# EasyEDA Pro project Baby8-Seq.eprj

# Board Board
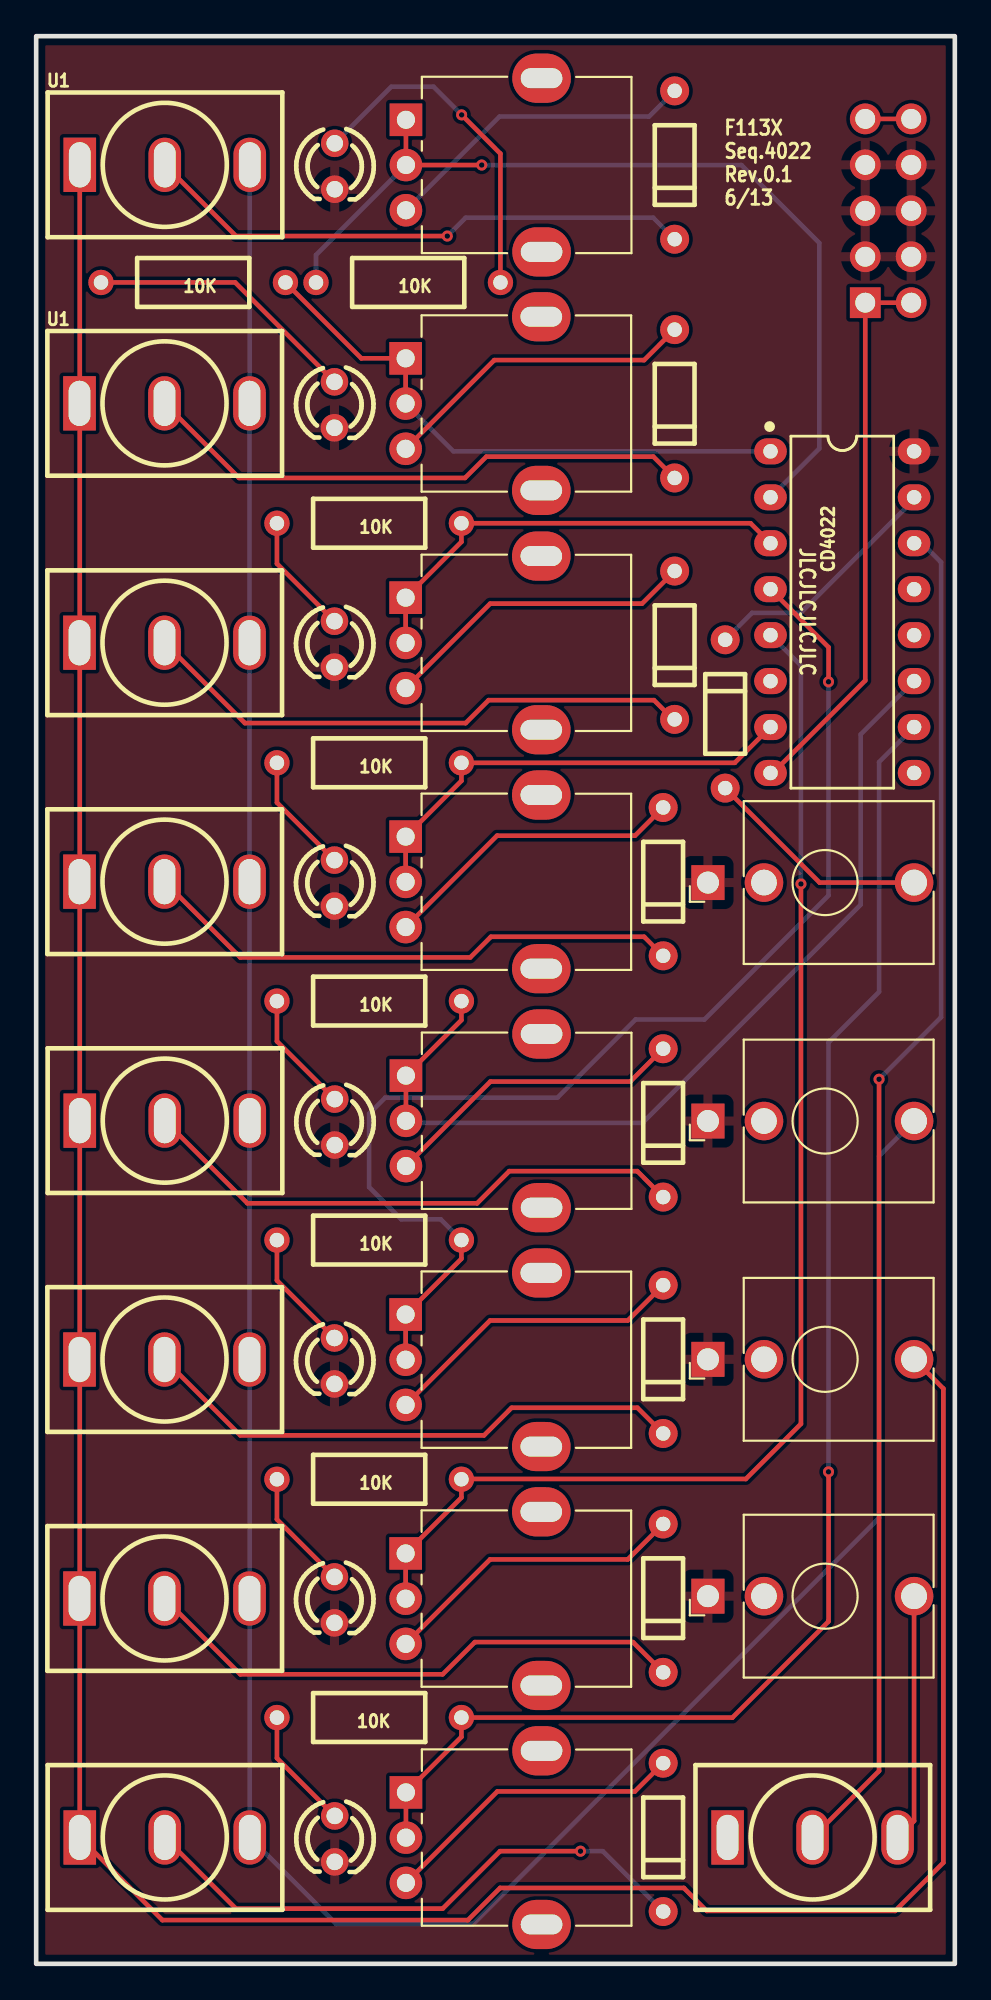
[diagram p0: board, top side]
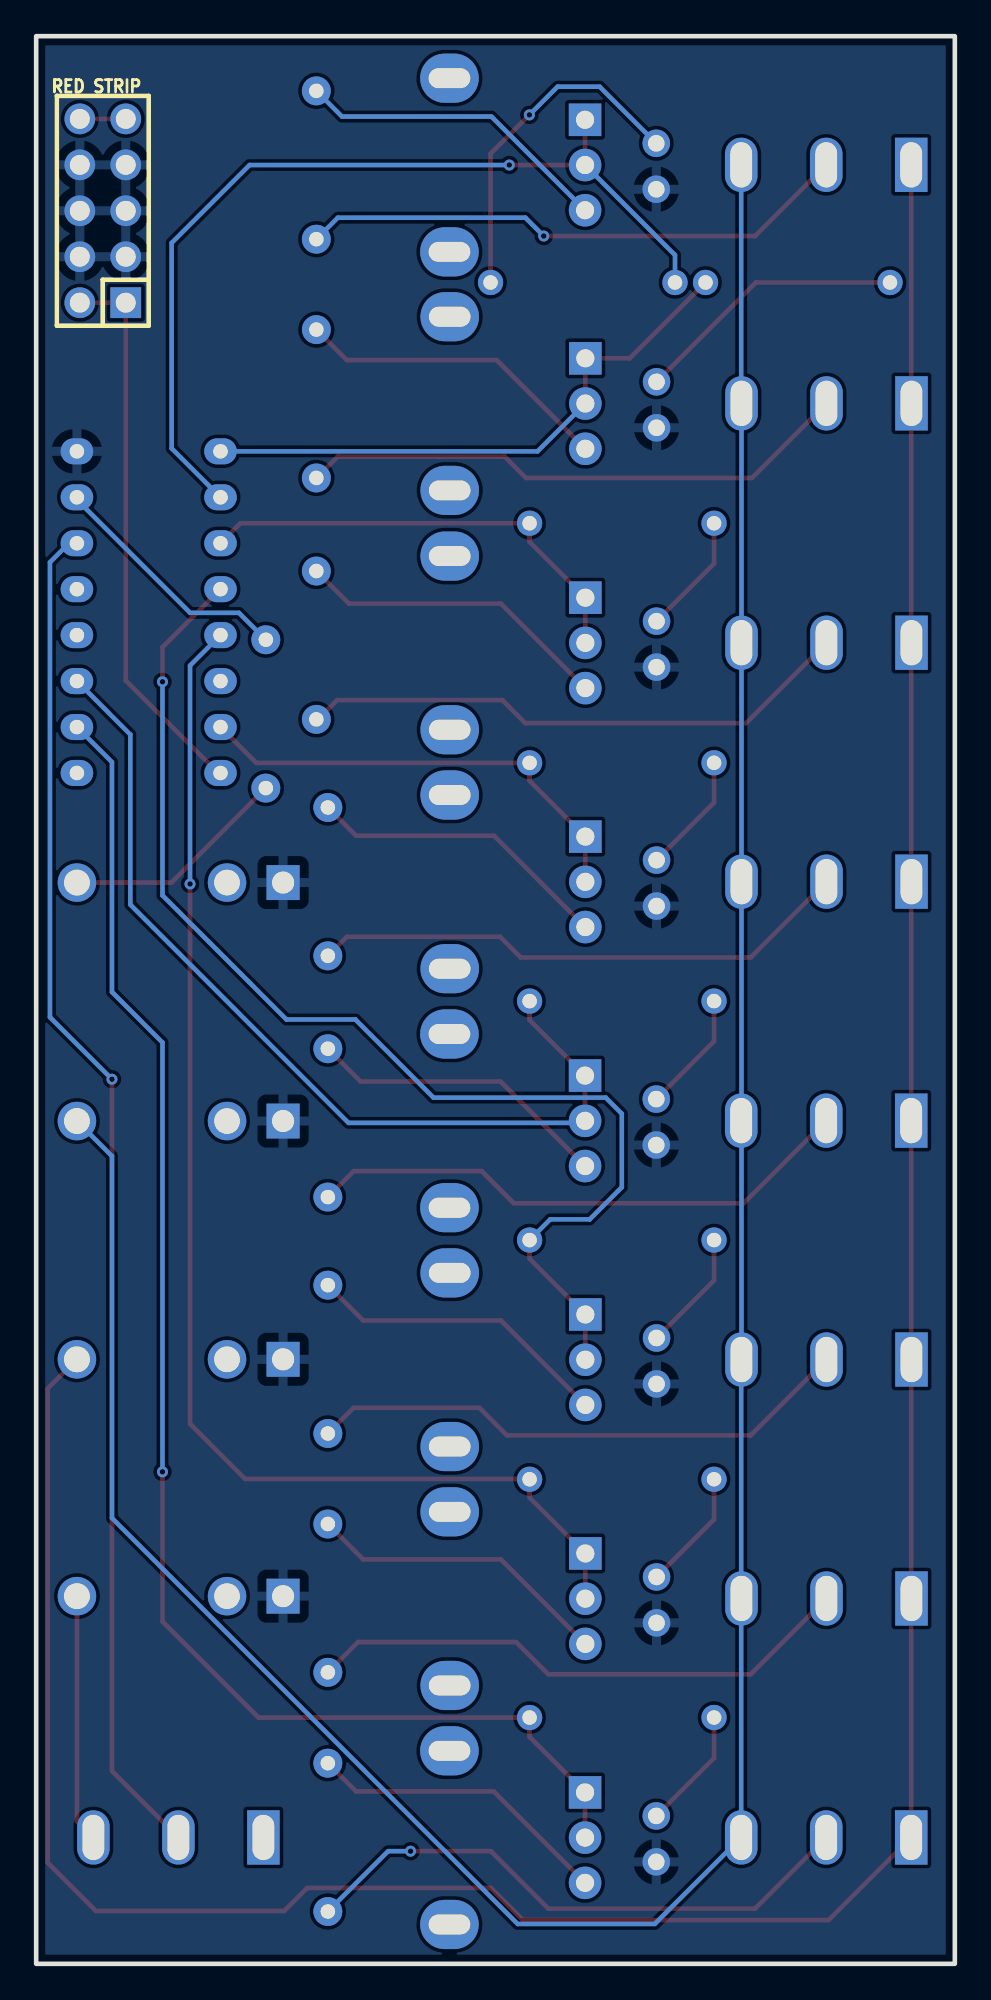
[diagram p1: board, bottom side, seen from below]

Outline 50.8 x 106.56 mm; copper layers: Top Layer, Bottom Layer. Coordinates in mm from the lower left corner of the outline.
Outline path: rectangle 0,106.56 50.8,0
Stack: Top Layer 0.035mm / Dielectric1 1.51mm FR4 er 4.5 / Bottom Layer 0.035mm

## Design rules (mm)
template: JLCPCB Capability(Two Layers Board)
spacing copperThickness1oz (default): track to track 0.102, other pairs 0.152 to 0.3
spacing copperThickness2oz: track to track 0.203, other pairs 0.152 to 0.3
track width copperThickness1oz (default): min 0.127, default 0.254, max 2.54
track width copperThickness2oz: min 0.203, default 0.254, max 2.54
differential pair differentialPair (default): width min 0.127, default 0.254, max 2.54; gap min 0.152, default 0.152
via viaSize (default): diameter min 0.5, default 0.61, max 10; hole min 0.3, default 0.305, max 6.3

## Placement (name value [footprint] x y rotation side)
10K  -  [RES-TH_BD2.7-L6.2-P10.20-D0.4]  20.57 92.94 0 top
10K#2  -  [RES-TH_BD2.7-L6.2-P10.20-D0.4]  8.69 92.94 0 top
10K#3  -  [RES-TH_BD2.7-L6.2-P10.20-D0.4]  18.41 79.63 0 top
10K#4  -  [RES-TH_BD2.7-L6.2-P10.20-D0.4]  18.41 66.39 0 top
10K#5  -  [RES-TH_BD2.7-L6.2-P10.20-D0.4]  18.41 53.22 0 top
10K#6  -  [RES-TH_BD2.7-L6.2-P10.20-D0.4]  18.41 40.01 0 top
10K#7  -  [RES-TH_BD2.7-L6.2-P10.20-D0.4]  18.41 26.78 0 top
10K#8  -  [RES-TH_BD2.7-L6.2-P10.20-D0.4]  18.41 13.61 0 top
CD4022  CD4017CN  [PDIP-16_L19.3-W6.4-P2.54-LS7.94-BL]  44.58 74.72 270 top
D1  -  [DO-35_BD2.0-L4.2-P8.20-D0.5-RD]  34.67 59.82 90 top
D1#2  -  [DO-35_BD2.0-L4.2-P8.20-D0.5-RD]  35.31 99.43 90 top
D1#3  -  [DO-35_BD2.0-L4.2-P8.20-D0.5-RD]  35.31 86.24 90 top
D1#4  -  [DO-35_BD2.0-L4.2-P8.20-D0.5-RD]  35.31 72.89 90 top
D1#5  -  [DO-35_BD2.0-L4.2-P8.20-D0.5-RD]  34.67 46.48 90 top
D1#6  -  [DO-35_BD2.0-L4.2-P8.20-D0.5-RD]  34.67 33.42 90 top
D1#7  -  [DO-35_BD2.0-L4.2-P8.20-D0.5-RD]  34.67 20.21 90 top
D1#8  -  [DO-35_BD2.0-L4.2-P8.20-D0.5-RD]  34.67 6.99 90 top
D1#9  -  [DO-35_BD2.0-L4.2-P8.20-D0.5-RD]  38.1 69.09 270 top
J2  -  [benjiaomodular:AudioJack_3.5mm]  37.15 46.59 90 top
J2#2  -  [benjiaomodular:AudioJack_3.5mm]  37.15 33.42 90 top
J2#3  -  [benjiaomodular:AudioJack_3.5mm]  37.15 20.32 90 top
J2#4  -  [benjiaomodular:AudioJack_3.5mm]  37.15 59.77 90 top
LED1  -  [LED-TH_BD3.0-P2.54-FD]  16.5 72.95 270 top
LED1#2  -  [LED-TH_BD3.0-P2.54-FD]  16.5 59.74 270 top
LED1#3  -  [LED-TH_BD3.0-P2.54-FD]  16.51 46.53 270 top
LED1#4  -  [LED-TH_BD3.0-P2.54-FD]  16.51 6.91 270 top
LED1#5  -  [LED-TH_BD3.0-P2.54-FD]  16.5 20.12 270 top
LED1#6  -  [LED-TH_BD3.0-P2.54-FD]  16.5 33.32 270 top
LED1#7  -  [LED-TH_BD3.0-P2.54-FD]  16.51 99.36 270 top
LED1#8  -  [LED-TH_BD3.0-P2.54-FD]  16.5 86.18 270 top
RED STRIP  ZX-PZ2.54-2-5PZZ  [HDR-TH_10P-P2.54-V-M-R2-C5-S2.54]  47.12 96.9 90 bottom
RV7  -  [benjiaomodular:Potentiometer_RV09]  20.43 75.52 0 top
RV7#2  -  [benjiaomodular:Potentiometer_RV09]  20.43 62.31 0 top
RV7#3  -  [benjiaomodular:Potentiometer_RV09]  20.45 49.1 0 top
RV7#4  -  [benjiaomodular:Potentiometer_RV09]  20.45 9.47 0 top
RV7#5  -  [benjiaomodular:Potentiometer_RV09]  20.43 35.89 0 top
RV7#6  -  [benjiaomodular:Potentiometer_RV09]  20.43 22.69 0 top
RV7#7  -  [benjiaomodular:Potentiometer_RV09]  20.45 101.93 0 top
RV7#8  -  [benjiaomodular:Potentiometer_RV09]  20.43 88.75 0 top
U1  -  [SW-TH_MT-0-103-A101-M200-RS]  7.1 73.03 0 top
U1#2  -  [SW-TH_MT-0-103-A101-M200-RS]  7.1 59.82 0 top
U1#3  -  [SW-TH_MT-0-103-A101-M200-RS]  7.11 46.61 0 top
U1#4  -  [SW-TH_MT-0-103-A101-M200-RS]  7.11 6.99 0 top
U1#5  -  [SW-TH_MT-0-103-A101-M200-RS]  7.1 20.2 0 top
U1#6  -  [SW-TH_MT-0-103-A101-M200-RS]  7.1 33.4 0 top
U1#7  -  [SW-TH_MT-0-103-A101-M200-RS]  42.94 6.99 0 top
U1#8  -  [SW-TH_MT-0-103-A101-M200-RS]  7.11 99.44 0 top
U1#9  -  [SW-TH_MT-0-103-A101-M200-RS]  7.1 86.26 0 top

## Footprints (pads in the part's own frame, mm; a bottom-side part is the same pattern mirrored in y, then rotated)
benjiaomodular:AudioJack_3.5mm
  rect 1.93x1.83 hole 1.22: S(0,0)
  round 2.13 hole 1.43: T(0,-11.4)
  round 2.13 hole 1.42: TN(0,-3.1)
benjiaomodular:Potentiometer_RV09
  rect 1.8x1.8 hole 1: 1(0,0)
  round 1.8 hole 1: 2(0,-2.5) 3(0,-5)
  oval 3.24x2.72 hole 2.3x1.1: 4(7.5,-7.3) 5(7.5,2.3)
DO-35_BD2.0-L4.2-P8.20-D0.5-RD
  round 1.6 hole 0.8: 1(-4.1,0) 2(4.1,0)
HDR-TH_10P-P2.54-V-M-R2-C5-S2.54
  rect 1.7x1.7 hole 1.1: 1(-5.08,-1.27)
  round 1.7 hole 1.1: 2(-5.08,1.27) 3(-2.54,-1.27) 4(-2.54,1.27) 5(0,-1.27) 6(0,1.27) 7(2.54,-1.27) 8(2.54,1.27) 9(5.08,-1.27) 10(5.08,1.27)
LED-TH_BD3.0-P2.54-FD
  round 1.524 hole 0.914: 1(-1.27,0) 2(1.27,0)
PDIP-16_L19.3-W6.4-P2.54-LS7.94-BL
  oval 1.44x1.8 hole 0.8: 1(-8.89,-3.97) 2(-6.35,-3.97) 3(-3.81,-3.97) 4(-1.27,-3.97) 5(1.27,-3.97) 6(3.81,-3.97) 7(6.35,-3.97) 8(8.89,-3.97) 9(8.89,3.97) 10(6.35,3.97) 11(3.81,3.97) 12(1.27,3.97) 13(-1.27,3.97) 14(-3.81,3.97) 15(-6.35,3.97) 16(-8.89,3.97)
RES-TH_BD2.7-L6.2-P10.20-D0.4
  round 1.4 hole 0.8: 1(-5.1,0) 2(5.1,0)
SW-TH_MT-0-103-A101-M200-RS
  rect 1.8x3 hole 1.2x2.5: 1(-4.7,0)
  oval 1.8x3 hole 1.2x2.5: 2(0,0) 3(4.7,0)

## Nets
GND: CD4022.16 J2.S J2#2.S J2#3.S J2#4.S LED1.2 LED1#2.2 LED1#3.2 LED1#4.2 LED1#5.2 LED1#6.2 LED1#7.2 LED1#8.2 RED STRIP.3 RED STRIP.4 RED STRIP.5 RED STRIP.6 RED STRIP.7 RED STRIP.8
+12: CD4022.8 RED STRIP.1 RED STRIP.2
-12: RED STRIP.9 RED STRIP.10
CLK: CD4022.14 U1#7.2
CLK_IN: J2#3.T U1#7.3
CV_OUT1: J2.T U1.3 U1#2.3 U1#3.3 U1#4.3 U1#5.3 U1#6.3 U1#8.3 U1#9.3
CV_OUT2: J2#2.T U1.1 U1#2.1 U1#3.1 U1#4.1 U1#5.1 U1#6.1 U1#8.1 U1#9.1
RST: CD4022.15 D1#9.1
RST_IN: D1#9.2 J2#4.T
STEP1: 10K.1 CD4022.2 RV7#7.1 RV7#7.2
STEP2: 10K#2.2 CD4022.1 RV7#8.1 RV7#8.2
STEP3: 10K#3.2 CD4022.3 RV7.1 RV7.2
STEP4: 10K#4.2 CD4022.7 RV7#2.1 RV7#2.2
STEP5: 10K#5.2 CD4022.11 RV7#3.1 RV7#3.2
STEP6: 10K#6.2 CD4022.4 RV7#5.1 RV7#5.2
STEP7: 10K#7.2 CD4022.5 RV7#6.1 RV7#6.2
STEP8: 10K#8.2 CD4022.10 RV7#4.1 RV7#4.2

Pads without a net: 10K 2; 10K#2 1; 10K#3 1; 10K#4 1; 10K#5 1; 10K#6 1; 10K#7 1; 10K#8 1; CD4022 6 9 12 13; D1 1 2; D1#2 1 2; D1#3 1 2; D1#4 1 2; D1#5 1 2; D1#6 1 2; D1#7 1 2; D1#8 1 2; J2 TN; J2#2 TN; J2#3 TN; J2#4 TN; LED1 1; LED1#2 1; LED1#3 1; LED1#4 1; LED1#5 1; LED1#6 1; LED1#7 1; LED1#8 1; RV7 3 4 5; RV7#2 3 4 5; RV7#3 3 4 5; RV7#4 3 4 5; RV7#5 3 4 5; RV7#6 3 4 5; RV7#7 3 4 5; RV7#8 3 4 5; U1 2; U1#2 2; U1#3 2; U1#4 2; U1#5 2; U1#6 2; U1#7 1; U1#8 2; U1#9 2

## Via types
v1: diameter 0.61, hole 0.305, Top Layer to Bottom Layer, 8 vias

## Routing (per net, layer and track width the routed paths; a pad name or vN(x,y) marks a point on that pad's centre or on a via; arc(x,y) is an arc through that point)
(no net): length 459
  Top Layer w0.254: 10K.2 25.67,100.06 v1(23.53,102.21) ; LED1#8.1 11,92.94 3.58,92.94 ; LED1#5.1 13.31,24.57 10K#7.1 ; D1#7.1 33,17.78 24.26,17.78 22.48,16 11.29,16 U1#5.2 ; LED1#4.1 13.31,11.37 10K#8.1 ; 10K#5.1 13.31,50.99 LED1#3.1 ; D1#8.2 33.11,9.53 25.5,9.53 RV7#4.3 ; U1#4.2 11.05,3.05 22.48,3.05 25.65,6.23 v1(30.1,6.23) ; 10K#3.1 13.31,77.4 LED1.1 ; RV7#3.3 25.12,48.77 32.86,48.77 34.67,50.58 ; v1(22.73,95.51) 11.05,95.51 U1#8.2 ; D1#3.2 33.62,88.65 25.33,88.65 RV7#8.3 ; U1#3.2 11.68,42.04 24.38,42.04 26.16,43.82 33.24,43.82 D1#5.1 ; D1#6.1 33.25,30.74 26.29,30.74 24.76,29.21 11.29,29.21 U1#6.2 ; 10K#6.1 13.31,37.77 LED1#6.1 ; D1#4.1 35.22,68.79 34.16,69.85 25.02,69.85 23.75,68.58 11.54,68.58 U1.2 ; RV7#6.3 25.1,22.35 32.71,22.35 D1#7.2 ; U1#2.2 11.29,55.63 24,55.63 25.15,56.77 33.62,56.77 D1.1 ; RV7#5.3 25.1,35.56 32.72,35.56 D1#6.2 ; D1.2 33.11,62.36 25.48,62.36 RV7#2.3 ; 10K#4.1 13.31,64.19 LED1#2.1 ; U1#9.2 11.22,82.14 23.71,82.14 24.89,83.31 34.13,83.31 D1#3.1 ; RV7.3 25.1,75.19 33.5,75.19 D1#4.2
  Bottom Layer w0.254: D1#2.1 34.12,96.52 23.75,96.52 v1(22.73,95.51) ; v1(23.53,102.21) 21.97,103.76 19.64,103.76 LED1#7.1 ; v1(30.1,6.23) 31.34,6.23 D1#8.1 ; D1#2.2 33.88,102.11 25.62,102.11 RV7#7.3
+12: length 30.7
  Top Layer w0.254: RED STRIP.2 45.85,91.82 45.85,70.94 40.73,65.83
-12: length 2.5
  Top Layer w0.254: RED STRIP.10 45.85,101.98
CLK: length 75.2
  Top Layer w0.254: U1#7.2 46.61,10.66 v1(46.61,48.9)
  Bottom Layer w0.254: 48.67,78.53 48.98,78.53 50.04,77.47 50.04,52.33 v1(46.61,48.9)
CLK_IN: length 13.7
  Top Layer w0.254: J2#3.T 48.55,7.9 U1#7.3
CV_OUT1: length 161.3
  Bottom Layer w0.254: J2.T 46.61,44.65 46.61,24.64 24.17,2.2 16.59,2.2 U1#4.3 11.81,33.39 U1#6.3 U1#2.3 U1.3 U1#9.3 11.81,86.27 U1#8.3
CV_OUT2: length 173
  Top Layer w0.254: J2#2.T 50.16,31.8 50.16,5.59 47.5,2.92 37.08,2.92 35.81,4.19 25.65,4.19 23.88,2.42 6.98,2.42 U1#4.1 U1#3.1 U1#8.1
RST: length 13.8
  Bottom Layer w0.254: D1#9.1 39.59,74.68 42.29,74.68 48.67,81.07
RST_IN: length 12.6
  Top Layer w0.254: 38.1,64.99 43.32,59.77 J2#4.T
STEP1: length 50.9
  Top Layer w0.254: v1(24.64,99.43) RV7#7.2 RV7#7.1
  Bottom Layer w0.254: CD4022.2 43.31,83.77 43.31,95.13 39,99.43 v1(24.64,99.43) ; RV7#7.2 15.47,94.46 10K.1
STEP2: length 32.2
  Top Layer w0.254: RV7#8.2 RV7#8.1 17.98,88.75 13.79,92.94
  Bottom Layer w0.254: CD4022.1 23.07,83.61 RV7#8.2
STEP3: length 25.4
  Top Layer w0.254: CD4022.3 39.5,79.63 10K#3.2 23.51,78.6 RV7.1 RV7.2
STEP4: length 25.8
  Top Layer w0.254: RV7#2.2 RV7#2.1 23.51,65.39 10K#4.2 38.63,66.39 CD4022.7
STEP5: length 51.7
  Top Layer w0.254: 10K#5.2 23.51,52.17 RV7#3.1 RV7#3.2
  Bottom Layer w0.254: CD4022.11 45.59,67.95 45.59,58.55 33.53,46.48 20.56,46.48 RV7#3.2
STEP6: length 66.9
  Top Layer w0.254: CD4022.4 43.81,72.78 v1(43.81,70.87) ; 10K#6.2 23.51,38.98 RV7#5.1 RV7#5.2
  Bottom Layer w0.254: 10K#6.2 22.37,41.15 20.19,41.15 18.41,42.93 18.41,46.99 19.3,47.88 28.83,47.88 33.15,52.2 36.96,52.2 43.81,59.06 v1(43.81,70.87)
STEP7: length 72.2
  Top Layer w0.254: v1(42.29,59.69) 42.29,29.85 39.24,26.8 23.53,26.8 10K#7.2 23.51,25.77 RV7#6.1 RV7#6.2
  Bottom Layer w0.254: CD4022.5 42.29,71.76 v1(42.29,59.69)
STEP8: length 81.8
  Top Layer w0.254: v1(43.81,27.2) 43.81,18.93 38.5,13.61 10K#8.2 23.51,12.54 RV7#4.1 RV7#4.2
  Bottom Layer w0.254: v1(43.81,27.2) 43.81,50.93 46.61,53.72 46.61,66.43 CD4022.10

## Copper pours and planes (outline as drawn; the poured copper is in the pictures)
GND on Top Layer: 0,106.68 50.8,106.68 50.8,0.13 0,0.13
GND on Bottom Layer: 0,106.56 50.8,106.56 50.8,0 0,0

## Text on the board
Top Silkscreen Layer: JLCJLCJLCJLC | F113X / Seq.4022 / Rev.0.1 / 6/13

# Board Panel
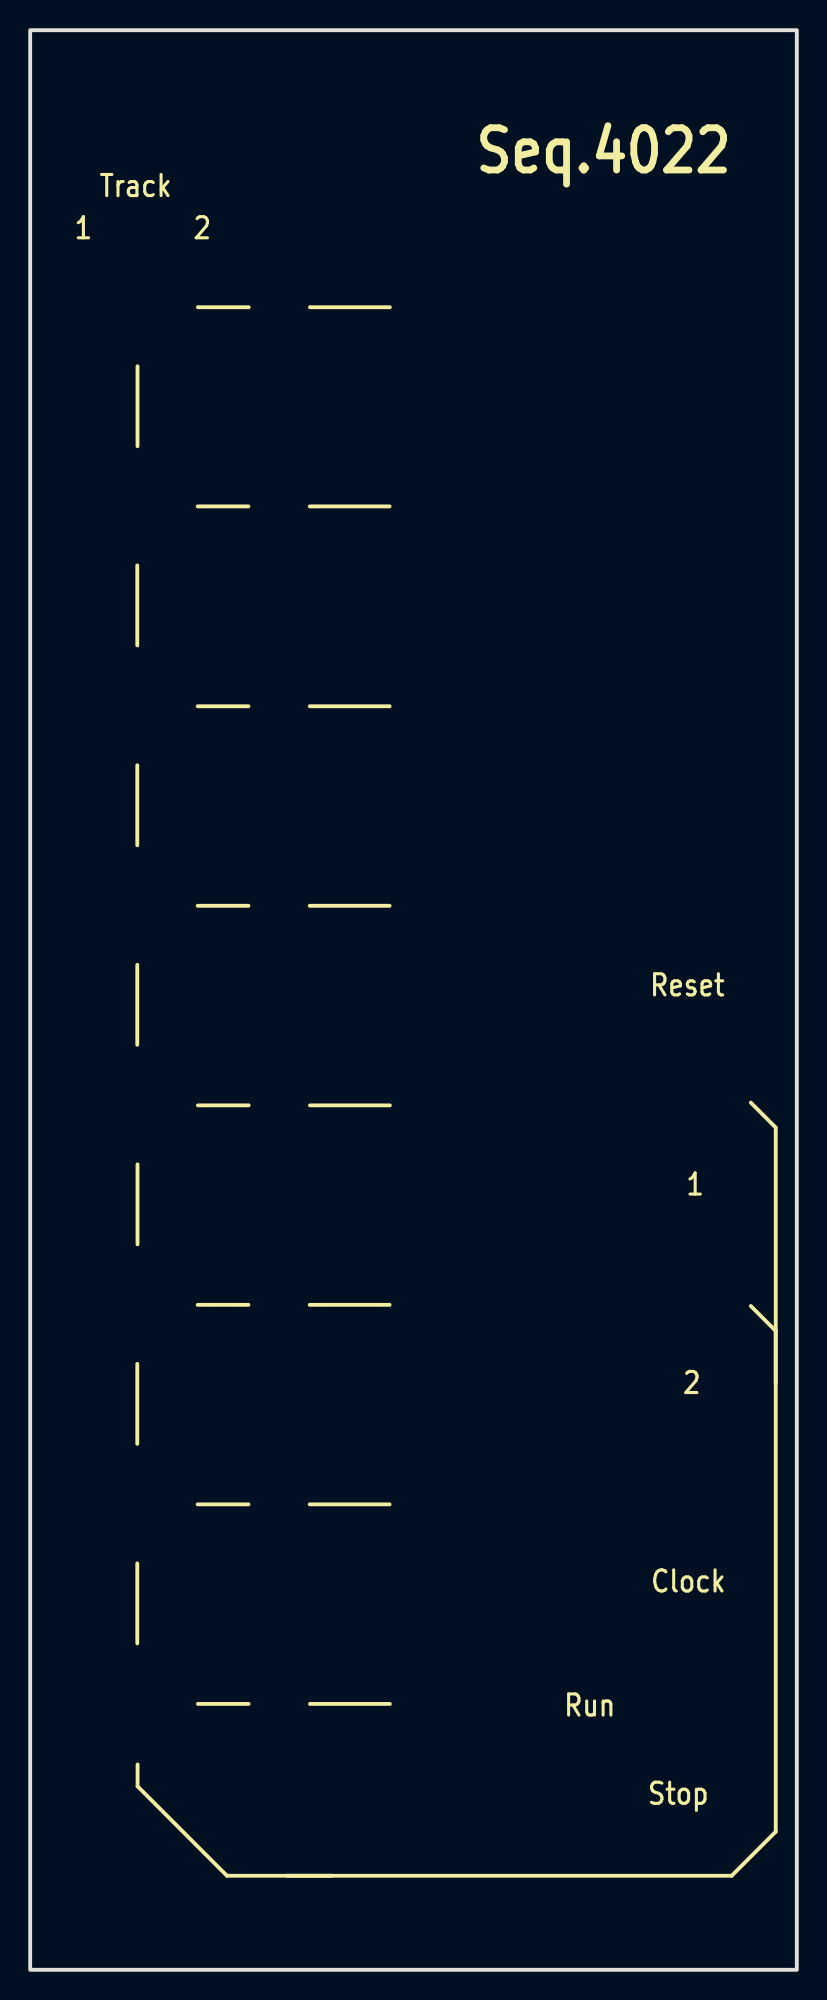
[diagram p2: board, top side]
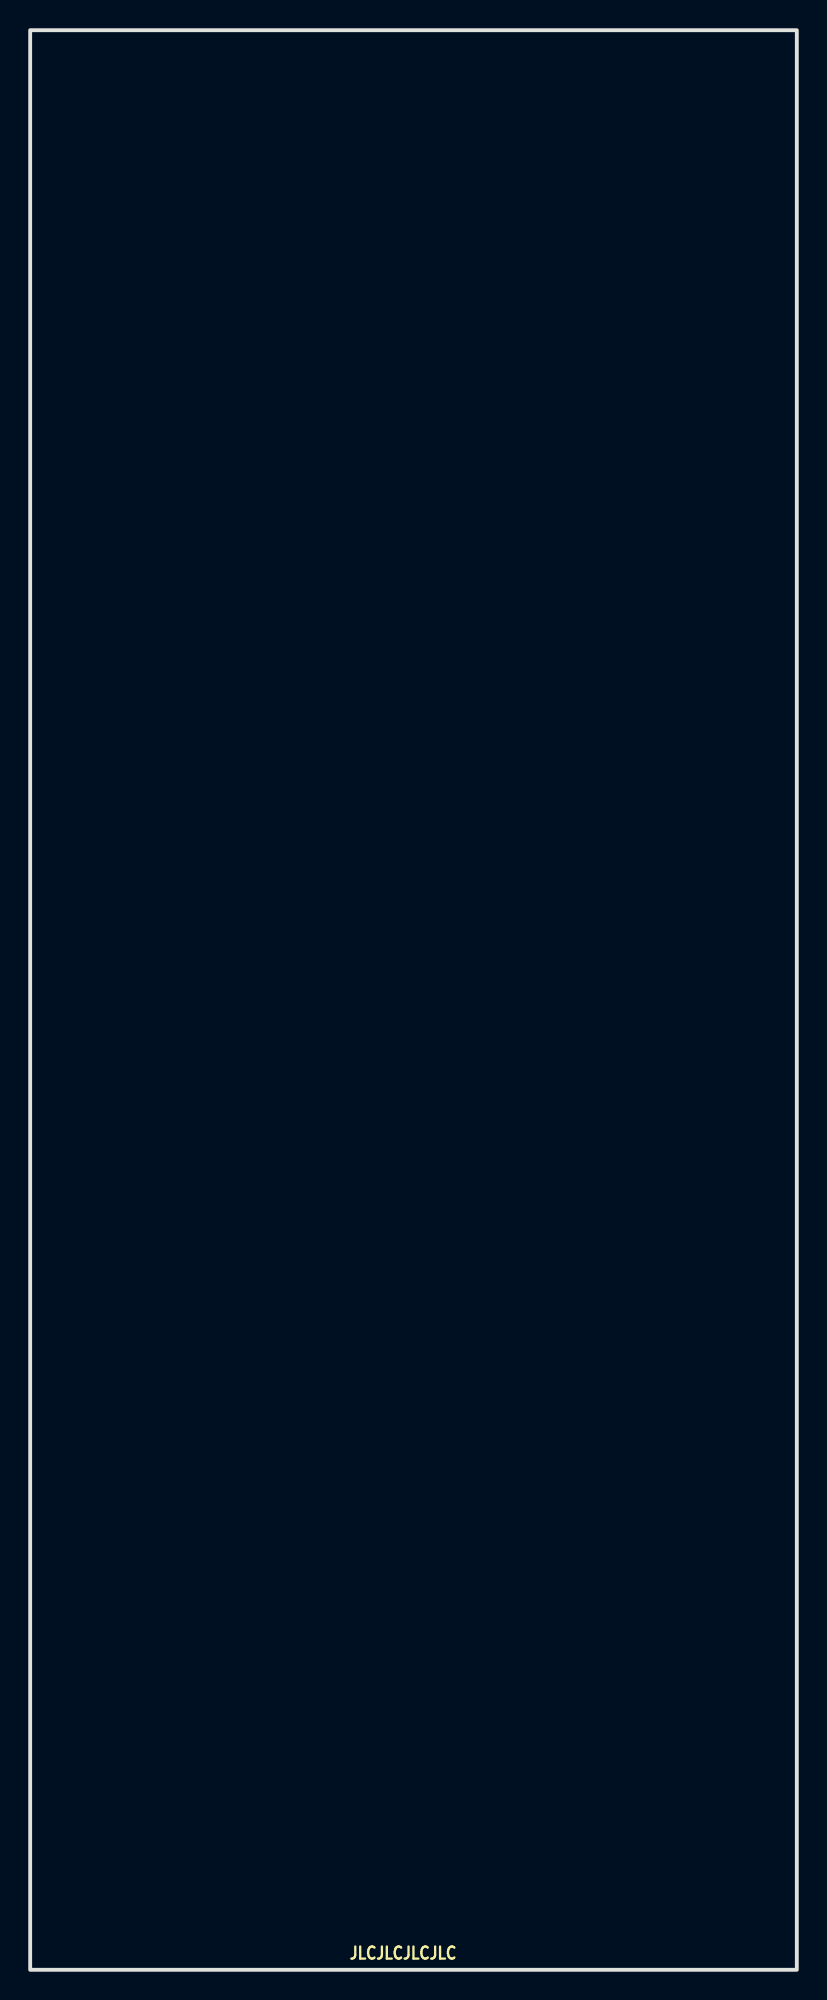
[diagram p3: board, bottom side, seen from below]

Outline 50.8 x 128.4 mm; copper layers: Top Layer, Bottom Layer. Coordinates in mm from the lower left corner of the outline.
Outline path: rectangle 0,128.4 50.8,0
Stack: Top Layer 0.035mm / Dielectric1 1.51mm FR4 er 4.5 / Bottom Layer 0.035mm

## Design rules (mm)
template: JLCPCB Capability(Two Layers Board)
spacing copperThickness1oz (default): track to track 0.102, other pairs 0.152 to 0.3
spacing copperThickness2oz: track to track 0.203, other pairs 0.152 to 0.3
track width copperThickness1oz (default): min 0.127, default 0.254, max 2.54
track width copperThickness2oz: min 0.203, default 0.254, max 2.54
differential pair differentialPair (default): width min 0.127, default 0.254, max 2.54; gap min 0.152, default 0.152
via viaSize (default): diameter min 0.5, default 0.61, max 10; hole min 0.3, default 0.305, max 6.3

## Placement (name value [footprint] x y rotation side)

## Nets

## Text on the board
Bottom Silkscreen Layer: JLCJLCJLCJLC
Top Silkscreen Layer: 1 | Track | 2 | Run | Stop | Reset | Clock | Seq.4022
